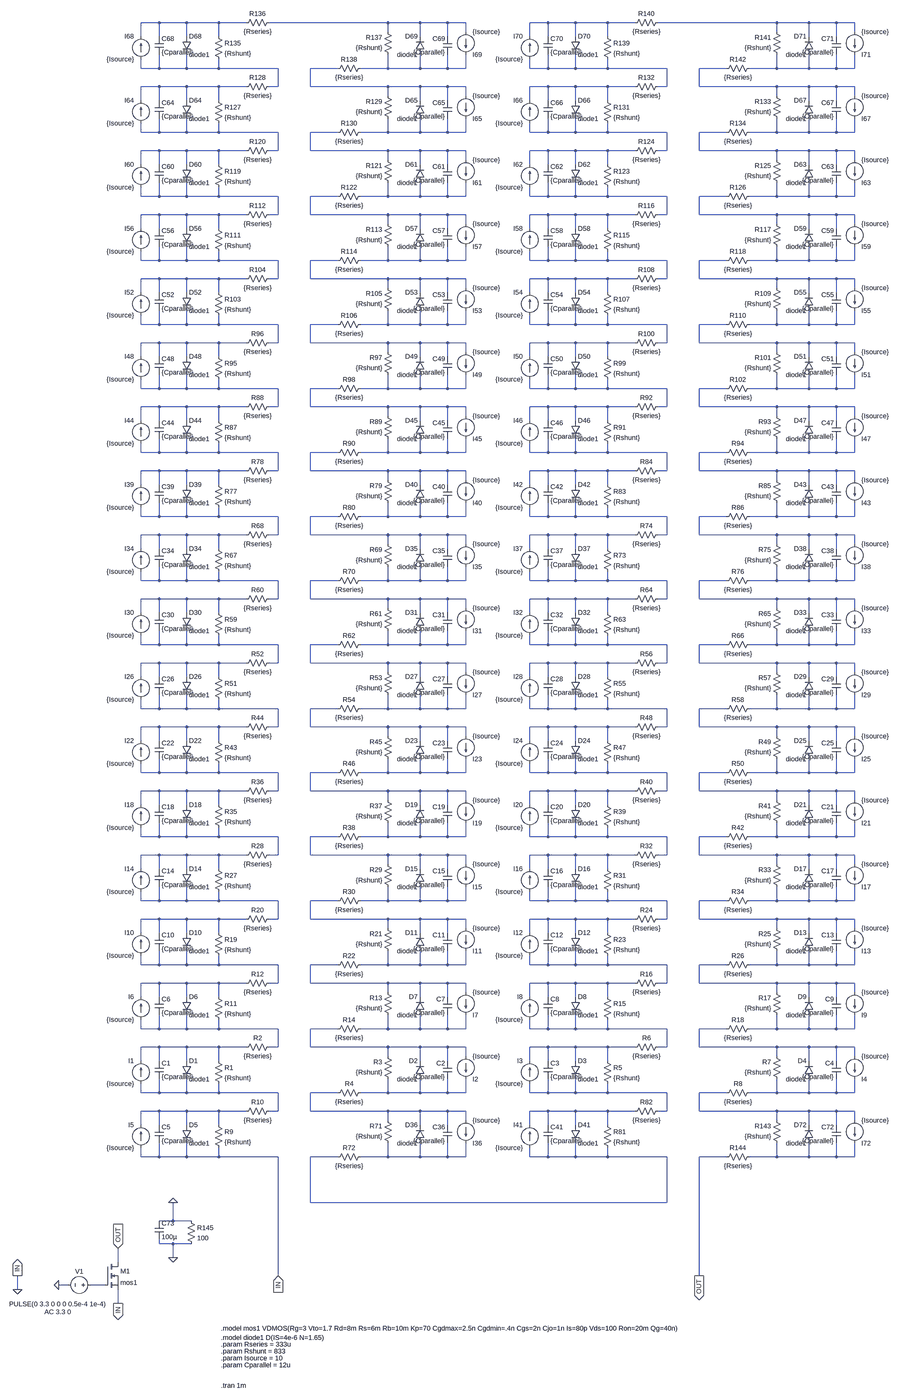
[diagram p0: schematic module-72cells-series--reference.asc, whole sheet]
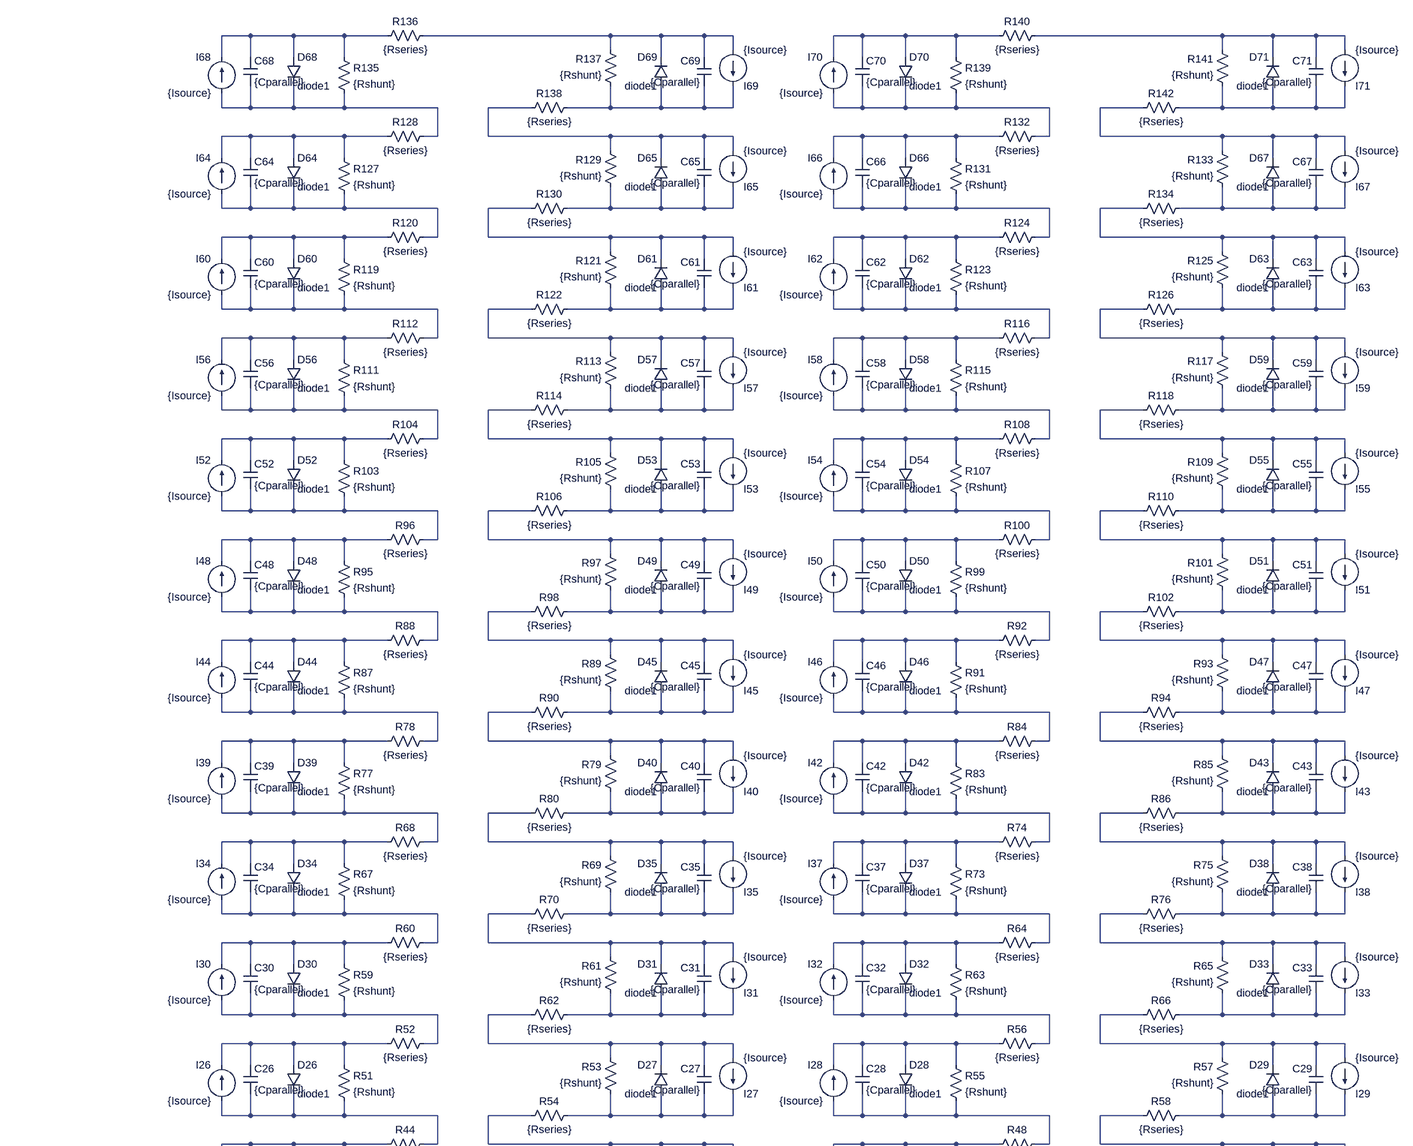
[diagram p1: schematic module-72cells-series--reference.asc, part, row 1 of 2, column 1 of 1]
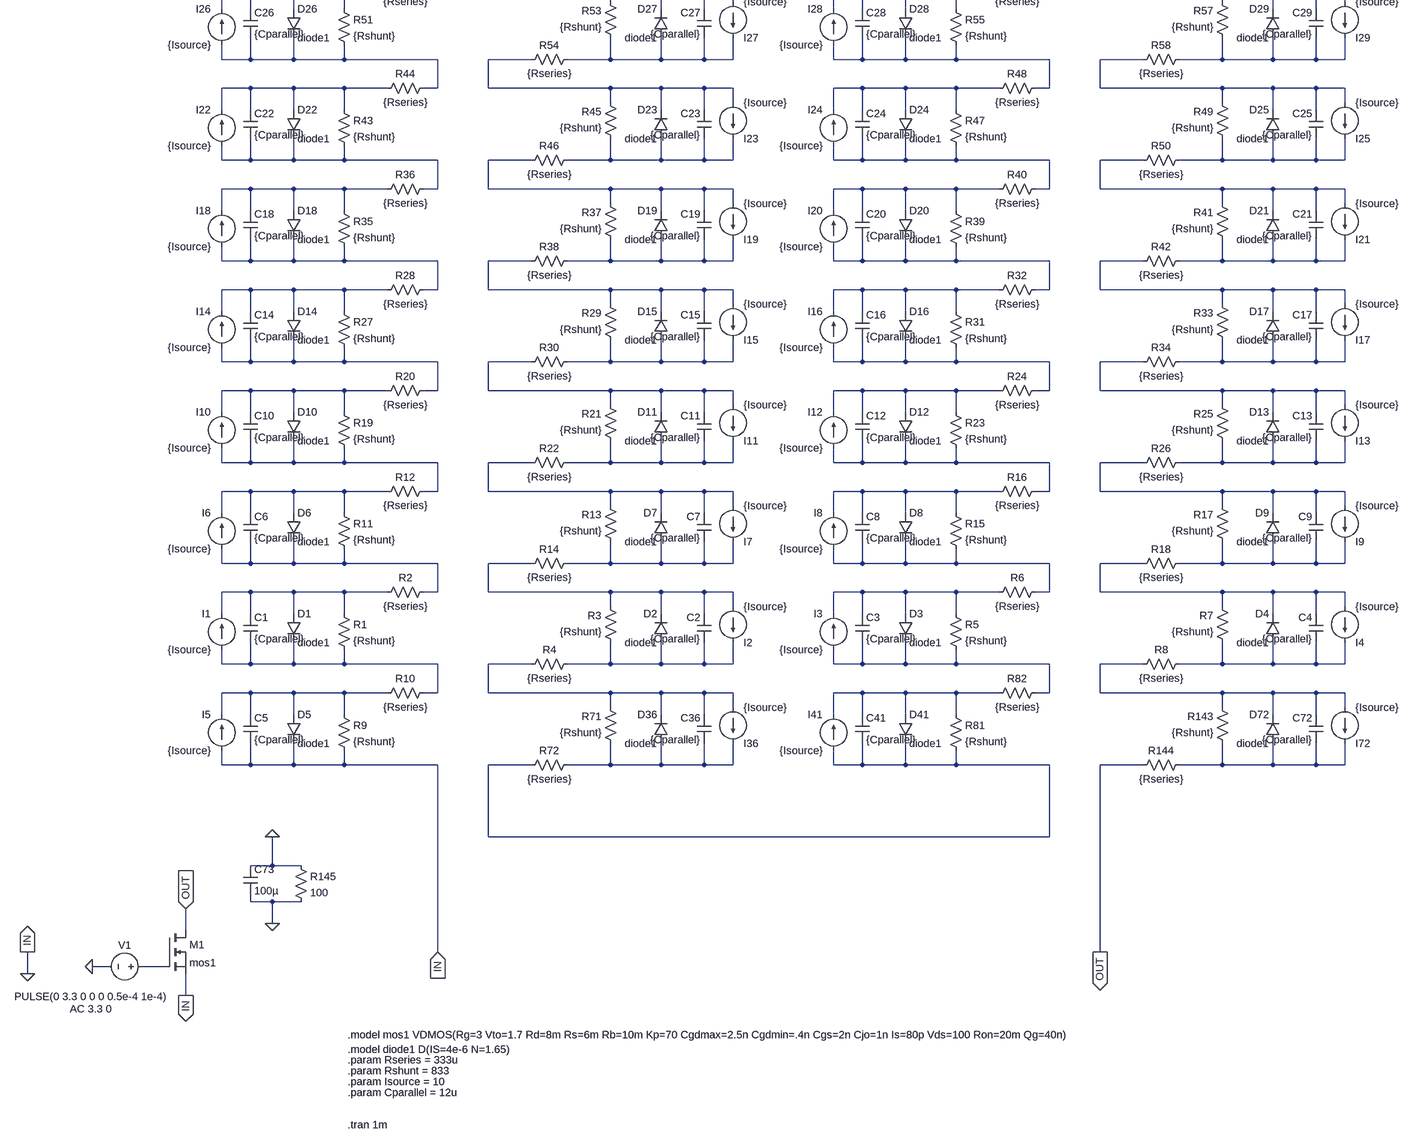
[diagram p2: schematic module-72cells-series--reference.asc, part, row 2 of 2, column 1 of 1]
* module-72cells-series--reference.asc
I5 0 N139 {Isource}
C5 N139 0 {Cparallel}
D5 N139 0 diode1
R9 N139 0 {Rshunt}
R10 N133 N139 {Rseries}
I36 N134 N142 {Isource}
C36 N142 N134 {Cparallel}
D36 N142 N134 diode1
R71 N142 N134 {Rshunt}
R72 N141 N142 {Rseries}
I41 N141 N140 {Isource}
C41 N140 N141 {Cparallel}
D41 N140 N141 diode1
R81 N140 N141 {Rshunt}
R82 N136 N140 {Rseries}
I72 N137 N143 {Isource}
C72 N143 N137 {Cparallel}
D72 N143 N137 diode1
R143 N143 N137 {Rshunt}
R144 OUT N143 {Rseries}
I1 N133 N131 {Isource}
C1 N131 N133 {Cparallel}
D1 N131 N133 diode1
R1 N131 N133 {Rshunt}
R2 N125 N131 {Rseries}
I2 N126 N135 {Isource}
C2 N135 N126 {Cparallel}
D2 N135 N126 diode1
R3 N135 N126 {Rshunt}
R4 N134 N135 {Rseries}
I3 N136 N132 {Isource}
C3 N132 N136 {Cparallel}
D3 N132 N136 diode1
R5 N132 N136 {Rshunt}
R6 N128 N132 {Rseries}
I4 N129 N138 {Isource}
C4 N138 N129 {Cparallel}
D4 N138 N129 diode1
R7 N138 N129 {Rshunt}
R8 N137 N138 {Rseries}
I6 N125 N123 {Isource}
C6 N123 N125 {Cparallel}
D6 N123 N125 diode1
R11 N123 N125 {Rshunt}
R12 N117 N123 {Rseries}
I7 N118 N127 {Isource}
C7 N127 N118 {Cparallel}
D7 N127 N118 diode1
R13 N127 N118 {Rshunt}
R14 N126 N127 {Rseries}
I8 N128 N124 {Isource}
C8 N124 N128 {Cparallel}
D8 N124 N128 diode1
R15 N124 N128 {Rshunt}
R16 N120 N124 {Rseries}
I9 N121 N130 {Isource}
C9 N130 N121 {Cparallel}
D9 N130 N121 diode1
R17 N130 N121 {Rshunt}
R18 N129 N130 {Rseries}
I10 N117 N115 {Isource}
C10 N115 N117 {Cparallel}
D10 N115 N117 diode1
R19 N115 N117 {Rshunt}
R20 N109 N115 {Rseries}
I11 N110 N119 {Isource}
C11 N119 N110 {Cparallel}
D11 N119 N110 diode1
R21 N119 N110 {Rshunt}
R22 N118 N119 {Rseries}
I12 N120 N116 {Isource}
C12 N116 N120 {Cparallel}
D12 N116 N120 diode1
R23 N116 N120 {Rshunt}
R24 N112 N116 {Rseries}
I13 N113 N122 {Isource}
C13 N122 N113 {Cparallel}
D13 N122 N113 diode1
R25 N122 N113 {Rshunt}
R26 N121 N122 {Rseries}
I14 N109 N107 {Isource}
C14 N107 N109 {Cparallel}
D14 N107 N109 diode1
R27 N107 N109 {Rshunt}
R28 N101 N107 {Rseries}
I15 N102 N111 {Isource}
C15 N111 N102 {Cparallel}
D15 N111 N102 diode1
R29 N111 N102 {Rshunt}
R30 N110 N111 {Rseries}
I16 N112 N108 {Isource}
C16 N108 N112 {Cparallel}
D16 N108 N112 diode1
R31 N108 N112 {Rshunt}
R32 N104 N108 {Rseries}
I17 N105 N114 {Isource}
C17 N114 N105 {Cparallel}
D17 N114 N105 diode1
R33 N114 N105 {Rshunt}
R34 N113 N114 {Rseries}
I18 N101 N099 {Isource}
C18 N099 N101 {Cparallel}
D18 N099 N101 diode1
R35 N099 N101 {Rshunt}
R36 N093 N099 {Rseries}
I19 N094 N103 {Isource}
C19 N103 N094 {Cparallel}
D19 N103 N094 diode1
R37 N103 N094 {Rshunt}
R38 N102 N103 {Rseries}
I20 N104 N100 {Isource}
C20 N100 N104 {Cparallel}
D20 N100 N104 diode1
R39 N100 N104 {Rshunt}
R40 N096 N100 {Rseries}
I21 N097 N106 {Isource}
C21 N106 N097 {Cparallel}
D21 N106 N097 diode1
R41 N106 N097 {Rshunt}
R42 N105 N106 {Rseries}
I22 N093 N091 {Isource}
C22 N091 N093 {Cparallel}
D22 N091 N093 diode1
R43 N091 N093 {Rshunt}
R44 N085 N091 {Rseries}
I23 N086 N095 {Isource}
C23 N095 N086 {Cparallel}
D23 N095 N086 diode1
R45 N095 N086 {Rshunt}
R46 N094 N095 {Rseries}
I24 N096 N092 {Isource}
C24 N092 N096 {Cparallel}
D24 N092 N096 diode1
R47 N092 N096 {Rshunt}
R48 N088 N092 {Rseries}
I25 N089 N098 {Isource}
C25 N098 N089 {Cparallel}
D25 N098 N089 diode1
R49 N098 N089 {Rshunt}
R50 N097 N098 {Rseries}
I26 N085 N083 {Isource}
C26 N083 N085 {Cparallel}
D26 N083 N085 diode1
R51 N083 N085 {Rshunt}
R52 N077 N083 {Rseries}
I27 N078 N087 {Isource}
C27 N087 N078 {Cparallel}
D27 N087 N078 diode1
R53 N087 N078 {Rshunt}
R54 N086 N087 {Rseries}
I28 N088 N084 {Isource}
C28 N084 N088 {Cparallel}
D28 N084 N088 diode1
R55 N084 N088 {Rshunt}
R56 N080 N084 {Rseries}
I29 N081 N090 {Isource}
C29 N090 N081 {Cparallel}
D29 N090 N081 diode1
R57 N090 N081 {Rshunt}
R58 N089 N090 {Rseries}
I30 N077 N075 {Isource}
C30 N075 N077 {Cparallel}
D30 N075 N077 diode1
R59 N075 N077 {Rshunt}
R60 N069 N075 {Rseries}
I31 N070 N079 {Isource}
C31 N079 N070 {Cparallel}
D31 N079 N070 diode1
R61 N079 N070 {Rshunt}
R62 N078 N079 {Rseries}
I32 N080 N076 {Isource}
C32 N076 N080 {Cparallel}
D32 N076 N080 diode1
R63 N076 N080 {Rshunt}
R64 N072 N076 {Rseries}
I33 N073 N082 {Isource}
C33 N082 N073 {Cparallel}
D33 N082 N073 diode1
R65 N082 N073 {Rshunt}
R66 N081 N082 {Rseries}
I34 N069 N067 {Isource}
C34 N067 N069 {Cparallel}
D34 N067 N069 diode1
R67 N067 N069 {Rshunt}
R68 N061 N067 {Rseries}
I35 N062 N071 {Isource}
C35 N071 N062 {Cparallel}
D35 N071 N062 diode1
R69 N071 N062 {Rshunt}
R70 N070 N071 {Rseries}
I37 N072 N068 {Isource}
C37 N068 N072 {Cparallel}
D37 N068 N072 diode1
R73 N068 N072 {Rshunt}
R74 N064 N068 {Rseries}
I38 N065 N074 {Isource}
C38 N074 N065 {Cparallel}
D38 N074 N065 diode1
R75 N074 N065 {Rshunt}
R76 N073 N074 {Rseries}
I39 N061 N059 {Isource}
C39 N059 N061 {Cparallel}
D39 N059 N061 diode1
R77 N059 N061 {Rshunt}
R78 N053 N059 {Rseries}
I40 N054 N063 {Isource}
C40 N063 N054 {Cparallel}
D40 N063 N054 diode1
R79 N063 N054 {Rshunt}
R80 N062 N063 {Rseries}
I42 N064 N060 {Isource}
C42 N060 N064 {Cparallel}
D42 N060 N064 diode1
R83 N060 N064 {Rshunt}
R84 N056 N060 {Rseries}
I43 N057 N066 {Isource}
C43 N066 N057 {Cparallel}
D43 N066 N057 diode1
R85 N066 N057 {Rshunt}
R86 N065 N066 {Rseries}
I44 N053 N051 {Isource}
C44 N051 N053 {Cparallel}
D44 N051 N053 diode1
R87 N051 N053 {Rshunt}
R88 N045 N051 {Rseries}
I45 N046 N055 {Isource}
C45 N055 N046 {Cparallel}
D45 N055 N046 diode1
R89 N055 N046 {Rshunt}
R90 N054 N055 {Rseries}
I46 N056 N052 {Isource}
C46 N052 N056 {Cparallel}
D46 N052 N056 diode1
R91 N052 N056 {Rshunt}
R92 N048 N052 {Rseries}
I47 N049 N058 {Isource}
C47 N058 N049 {Cparallel}
D47 N058 N049 diode1
R93 N058 N049 {Rshunt}
R94 N057 N058 {Rseries}
I48 N045 N043 {Isource}
C48 N043 N045 {Cparallel}
D48 N043 N045 diode1
R95 N043 N045 {Rshunt}
R96 N037 N043 {Rseries}
I49 N038 N047 {Isource}
C49 N047 N038 {Cparallel}
D49 N047 N038 diode1
R97 N047 N038 {Rshunt}
R98 N046 N047 {Rseries}
I50 N048 N044 {Isource}
C50 N044 N048 {Cparallel}
D50 N044 N048 diode1
R99 N044 N048 {Rshunt}
R100 N040 N044 {Rseries}
I51 N041 N050 {Isource}
C51 N050 N041 {Cparallel}
D51 N050 N041 diode1
R101 N050 N041 {Rshunt}
R102 N049 N050 {Rseries}
I52 N037 N035 {Isource}
C52 N035 N037 {Cparallel}
D52 N035 N037 diode1
R103 N035 N037 {Rshunt}
R104 N029 N035 {Rseries}
I53 N030 N039 {Isource}
C53 N039 N030 {Cparallel}
D53 N039 N030 diode1
R105 N039 N030 {Rshunt}
R106 N038 N039 {Rseries}
I54 N040 N036 {Isource}
C54 N036 N040 {Cparallel}
D54 N036 N040 diode1
R107 N036 N040 {Rshunt}
R108 N032 N036 {Rseries}
I55 N033 N042 {Isource}
C55 N042 N033 {Cparallel}
D55 N042 N033 diode1
R109 N042 N033 {Rshunt}
R110 N041 N042 {Rseries}
I56 N029 N027 {Isource}
C56 N027 N029 {Cparallel}
D56 N027 N029 diode1
R111 N027 N029 {Rshunt}
R112 N021 N027 {Rseries}
I57 N022 N031 {Isource}
C57 N031 N022 {Cparallel}
D57 N031 N022 diode1
R113 N031 N022 {Rshunt}
R114 N030 N031 {Rseries}
I58 N032 N028 {Isource}
C58 N028 N032 {Cparallel}
D58 N028 N032 diode1
R115 N028 N032 {Rshunt}
R116 N024 N028 {Rseries}
I59 N025 N034 {Isource}
C59 N034 N025 {Cparallel}
D59 N034 N025 diode1
R117 N034 N025 {Rshunt}
R118 N033 N034 {Rseries}
I60 N021 N019 {Isource}
C60 N019 N021 {Cparallel}
D60 N019 N021 diode1
R119 N019 N021 {Rshunt}
R120 N013 N019 {Rseries}
I61 N014 N023 {Isource}
C61 N023 N014 {Cparallel}
D61 N023 N014 diode1
R121 N023 N014 {Rshunt}
R122 N022 N023 {Rseries}
I62 N024 N020 {Isource}
C62 N020 N024 {Cparallel}
D62 N020 N024 diode1
R123 N020 N024 {Rshunt}
R124 N016 N020 {Rseries}
I63 N017 N026 {Isource}
C63 N026 N017 {Cparallel}
D63 N026 N017 diode1
R125 N026 N017 {Rshunt}
R126 N025 N026 {Rseries}
I64 N013 N011 {Isource}
C64 N011 N013 {Cparallel}
D64 N011 N013 diode1
R127 N011 N013 {Rshunt}
R128 N005 N011 {Rseries}
I65 N006 N015 {Isource}
C65 N015 N006 {Cparallel}
D65 N015 N006 diode1
R129 N015 N006 {Rshunt}
R130 N014 N015 {Rseries}
I66 N016 N012 {Isource}
C66 N012 N016 {Cparallel}
D66 N012 N016 diode1
R131 N012 N016 {Rshunt}
R132 N008 N012 {Rseries}
I67 N009 N018 {Isource}
C67 N018 N009 {Cparallel}
D67 N018 N009 diode1
R133 N018 N009 {Rshunt}
R134 N017 N018 {Rseries}
I68 N005 N001 {Isource}
C68 N001 N005 {Cparallel}
D68 N001 N005 diode1
R135 N001 N005 {Rshunt}
R136 N002 N001 {Rseries}
I69 N002 N007 {Isource}
C69 N007 N002 {Cparallel}
D69 N007 N002 diode1
R137 N007 N002 {Rshunt}
R138 N006 N007 {Rseries}
I70 N008 N003 {Isource}
C70 N003 N008 {Cparallel}
D70 N003 N008 diode1
R139 N003 N008 {Rshunt}
R140 N004 N003 {Rseries}
I71 N004 N010 {Isource}
C71 N010 N004 {Cparallel}
D71 N010 N004 diode1
R141 N010 N004 {Rshunt}
R142 N009 N010 {Rseries}
M1 OUT N144 0 0 mos1
V1 N144 0 PULSE(0 3.3 0 0 0 0.5e-4 1e-4) AC 3.3 0
R145 0 0 100
C73 0 0 100µ
.model D D
.lib standard.dio
.model NMOS NMOS
.model PMOS PMOS
.lib standard.mos
.model diode1 D(IS=4e-6 N=1.65)
.param Rshunt = 833
.param Rseries = 333u
.param Isource = 10
.param Cparallel = 12u
.model mos1 VDMOS(Rg=3 Vto=1.7 Rd=8m Rs=6m Rb=10m Kp=70 Cgdmax=2.5n Cgdmin=.4n Cgs=2n Cjo=1n Is=80p Vds=100 Ron=20m Qg=40n)
.tran 1m
.backanno
.end